# Altium schematic sheet 03-INPUT.SchDoc: *INPUT
size A4; SheetNumber: 4; SheetTotal: 7
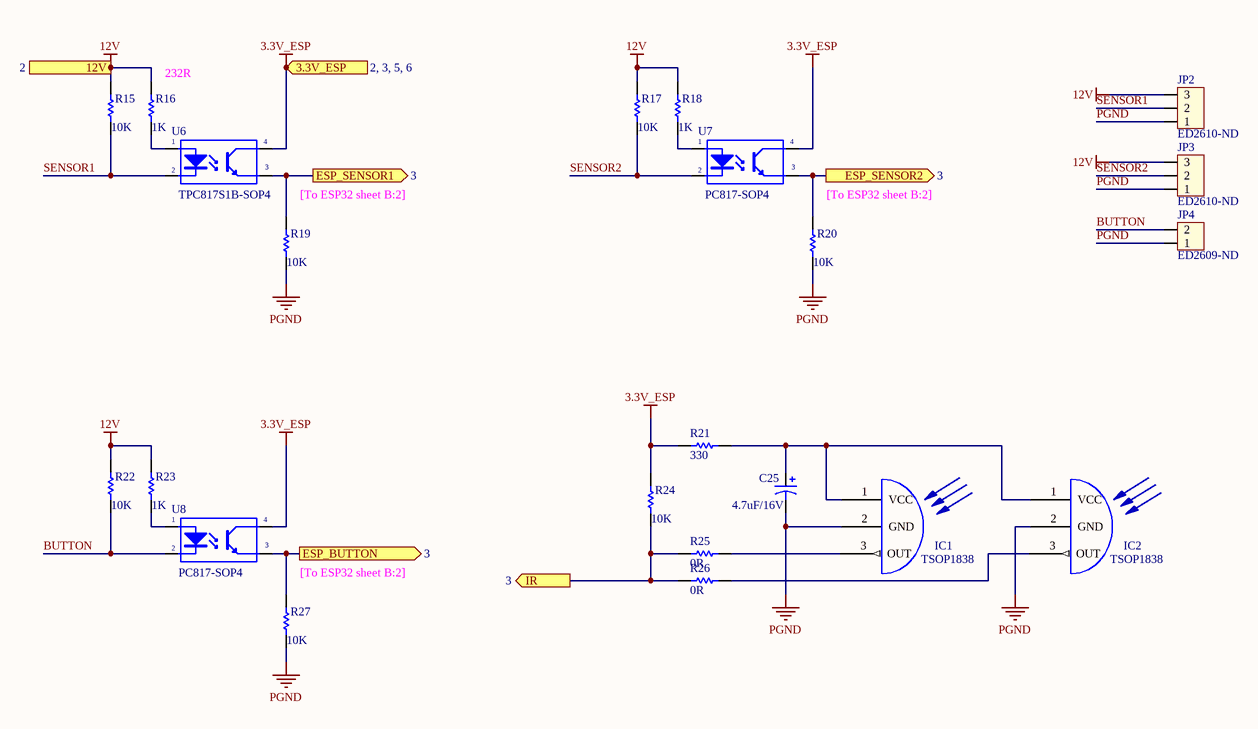
[diagram p0: 03-INPUT.SchDoc]

## Parts
C25  value 4.7uF/16V  [C0805]  (hidden comment: Cap Pol1)
IC1  TSOP1838  [TSOP1838]
IC2  TSOP1838  [TSOP1838]
JP2  ED2610-ND  [DOMINO_OSTTC_3P]
JP3  ED2610-ND  [DOMINO_OSTTC_3P]
JP4  ED2609-ND  [DOMINO_OSTTC_2P]
R15  10K  [Res 0805 SMD]
R16  1K  [Res 0805 SMD]
R17  10K  [Res 0805 SMD]
R18  1K  [Res 0805 SMD]
R19  10K  [Res 0805 SMD]
R20  10K  [Res 0805 SMD]
R21  330  [Res 0805 SMD]
R22  10K  [Res 0805 SMD]
R23  1K  [Res 0805 SMD]
R24  10K  [Res 0805 SMD]
R25  0R  [Res 0805 SMD]
R26  0R  [Res 0805 SMD]
R27  10K  [Res 0805 SMD]
U6  TPC817S1B-SOP4  [TPC817-4SOP]
U7  PC817-SOP4  [TPC817-4SOP]
U8  PC817-SOP4  [TPC817-4SOP]

## Ports
3.3V_ESP (in, see 2, 3, 5, 6), 12V (in, see 2), ESP_BUTTON (out, see 3), ESP_SENSOR1 (out, see 3), ESP_SENSOR2 (out, see 3), IR (out, see 3)

## Nets
3.3V_ESP: R21.2 R24.2 U6.4(C) U7.4(C) U8.4(C) ; port 3.3V_ESP
12V: JP2.3 JP3.3 R15.2 R16.2 R17.2 R18.2 R22.2 R23.2 ; port 12V
PGND: C25.2 IC1.2(GND) IC2.2(GND) JP2.1 JP3.1 JP4.1 R19.1 R20.1 R27.1
BUTTON: JP4.2 R22.1 U8.2(K)
ESP_BUTTON: R27.2 U8.3(E) ; port ESP_BUTTON
ESP_SENSOR1: R19.2 U6.3(E) ; port ESP_SENSOR1
ESP_SENSOR2: R20.2 U7.3(E) ; port ESP_SENSOR2
IR: R24.1 R25.2 R26.2 ; port IR
SENSOR1: JP2.2 R15.1 U6.2(K)
SENSOR2: JP3.2 R17.1 U7.2(K)
NetC25_1: C25.1 IC1.1(VCC) IC2.1(VCC) R21.1
NetIC1_3: IC1.3(OUT) R25.1
NetIC2_3: IC2.3(OUT) R26.1
NetR16_1: R16.1 U6.1(A)
NetR18_1: R18.1 U7.1(A)
NetR23_1: R23.1 U8.1(A)

## Notes on the sheet
- (near R16) 232R
- [To ESP32 sheet B:2]
- Title
- Size:
- Date:
- A4
- Number:
- Time:
- Revision:
- Sheet
- of
- File:

## Library data of the parts
C25 = Cap Pol1: Polarized Capacitor (Radial); Published: 8-Jun-2000; LatestRevisionDate: 17-Jul-2002; LatestRevisionNote: Re-released for DXP Platform.; PackageReference: RB7.6-15; Publisher: Altium Limited; PackageDescription: Polarized Capacitor (Radial); 2 Leads
JP2 JP3 = Con3: 3 Position Wire to Board Terminal Block Horizontal with Board 0.200" (5.08mm) Through Hole; Value: Connector 3; Digikey: ED2610-ND
JP4 = Con2: 2 Position Wire to Board Terminal Block Horizontal with Board 0.200" (5.08mm) Through Hole; Value: Connector 2; Digikey: ED2609-ND
R15 R17 R22 = 10K/R0603/1%: RES SMD 10K OHM 1% 1/10W 0603; Manufacturer: Yageo; Manufacturer Part Number: RC0603FR-0710KL; Power (Watts): 0.1W, 1/10W; Temperature Coefficient: ±100ppm/°C; Supplier 1: Digi-Key; RoHS: RoHS Compliant; Category: Resistors; Stock 1: 11440000; Pricing 1: 5000=0.00167, 10000=0.00145, 25000=0.00128, 50000=0.00117, 125000=0.00115 (USD); Packaging: Tape & Reel (TR); Resistance (Ohms): 10k; Tolerance: ±1%; Composition: Thick Film; Features: Moisture Resistant; Operating Temperature: -55°C ~ 155°C; Package / Case: 0603 (1608 Metric); Supplier Device Package: 0603; Size / Dimension: 0.063" L x 0.031" W (1.60mm x 0.80mm); Height: 0.022" (0.55mm); Number of Terminations: 2; ComponentLink1URL: http://www.yageo.com/NewPortal/yageodocoutput?fileName=/pdf/R-Chip/PYu-RC_Group_51_RoHS_L_3.pdf; ComponentLink1Description: http://www.yageo.com/NewPortal/yageodocoutput?fileName=/pdf/R-Chip/PYu-RC_Group_51_RoHS_L_3.pdf; Supplier Part Number 1: 311-10.0KHRTR-ND
R16 R18 R23 = 10K/R0603/1%: 1 kOhms ±1% 0.125W, 1/8W Chip Resistor 0805 (2012 Metric) Automotive AEC-Q200 Thick Film; Resistance (Ohms): 10k; Power (Watts): 0.1W, 1/10W; RoHS: RoHS Compliant; Category: Resistors; Features: Moisture Resistant; Operating Temperature: -55°C ~ 155°C; Package / Case: 0603 (1608 Metric); Supplier Device Package: 0603; Size / Dimension: 0.063" L x 0.031" W (1.60mm x 0.80mm); Height: 0.022" (0.55mm); Number of Terminations: 2; ComponentLink1URL: http://www.yageo.com/NewPortal/yageodocoutput?fileName=/pdf/R-Chip/PYu-RC_Group_51_RoHS_L_3.pdf; ComponentLink1Description: http://www.yageo.com/NewPortal/yageodocoutput?fileName=/pdf/R-Chip/PYu-RC_Group_51_RoHS_L_3.pdf; Digikey: 541-1.00KCCT-ND
R19-R21 R24-R27 = 249K/R0805/1%: RES SMD 249K OHM 1% 1/10W 0805; Manufacturer: Yageo; Manufacturer Part Number: RC0603FR-07249KL; Power (Watts): 0.1W, 1/10W; Temperature Coefficient: ±100ppm/°C; Supplier 1: Digi-Key; RoHS: RoHS Compliant; Category: Resistors; Stock 1: 370515; Pricing 1: 1=0.1, 10=0.015, 100=0.006, 1000=0.00268, 2500=0.00233 (USD); Packaging: Cut Tape (CT); Part Status: Active; Tolerance: ±1%; Composition: Thick Film; Features: Moisture Resistant; Operating Temperature: -55°C ~ 155°C; Package / Case: 0603 (1608 Metric); Supplier Device Package: 0603; Size / Dimension: 0.063" L x 0.032" W (1.60mm x 0.80mm); Height - Seated (Max): 0.022" (0.55mm); Failure Rate: -; ComponentLink1URL: http://www.yageo.com/documents/recent/PYu-RC_Group_51_RoHS_L_8.pdf; ComponentLink1Description: http://www.yageo.com/documents/recent/PYu-RC_Group_51_RoHS_L_8.pdf
U6-U8 = PC817: Optoisolator Transistor Output 5000Vrms 1 Channel 4-SOP; Digikey: TPC817S1BRAGCT-ND
  U7 U8: BuyVN: https://banlinhkien.vn/goods-1134-pc817-el817-sop4-opto.html